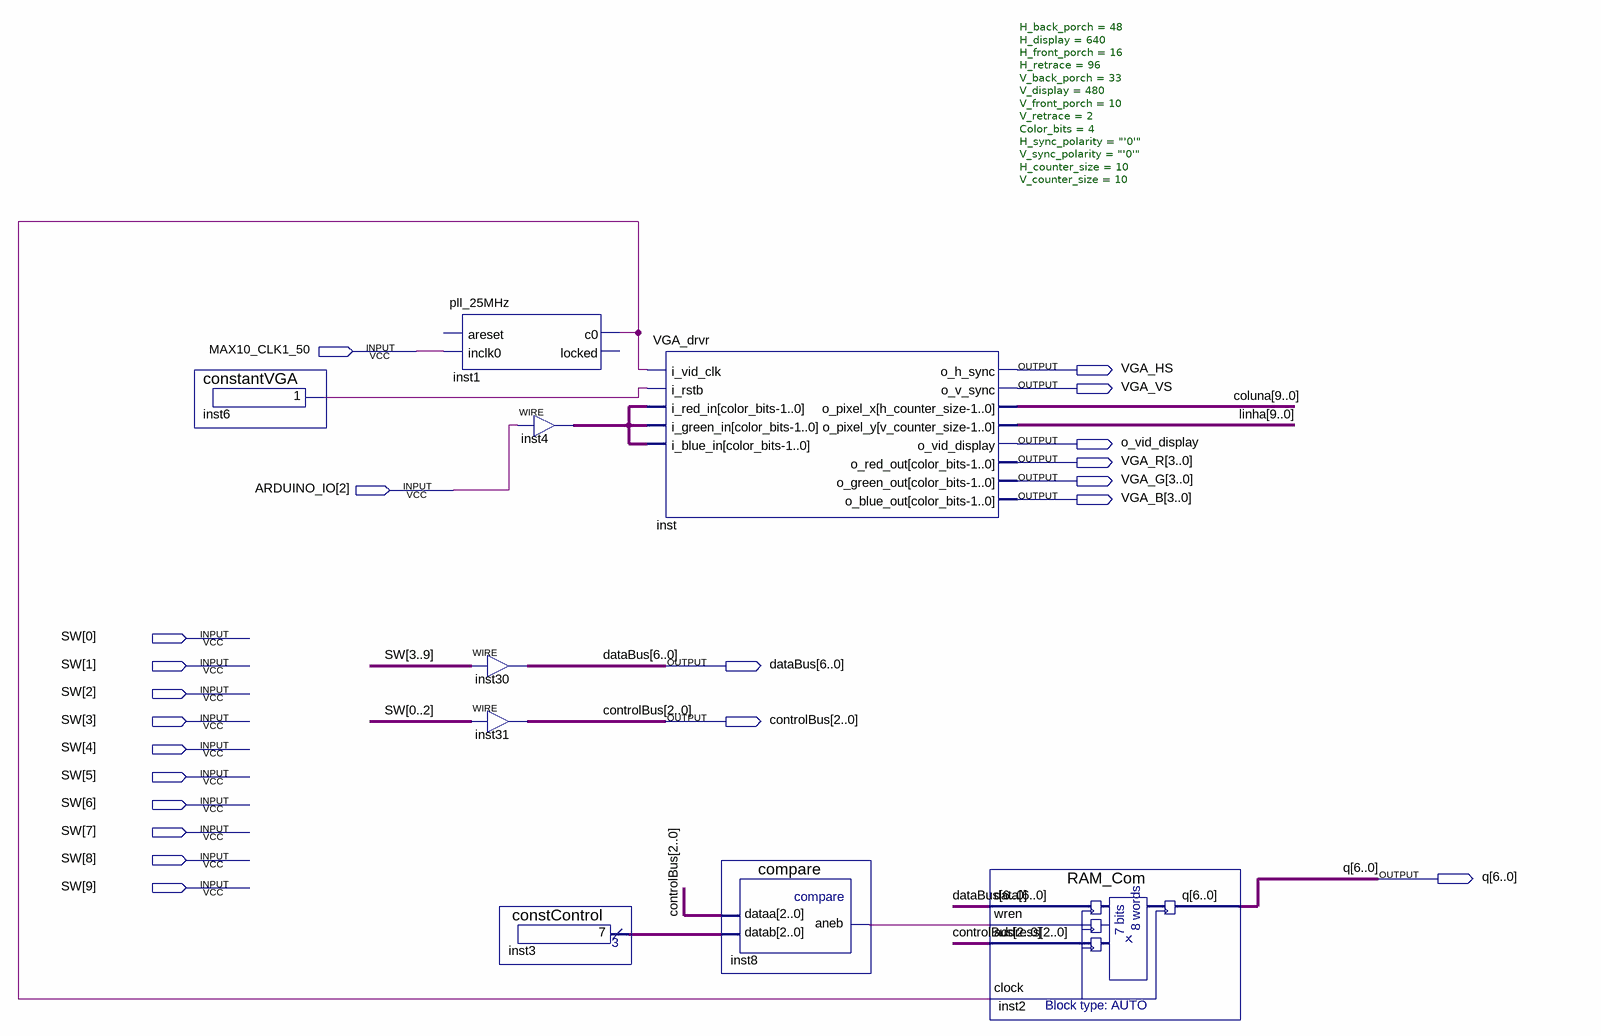
[diagram p0: schematic sheet]
// Quartus schematic vga1.bdf as structural Verilog: 9 symbols, 21 pins
module vga1 (
  input  MAX10_CLK1_50,
  input  [2:2] ARDUINO_IO,
  input  [9:0] SW,
  output VGA_HS,
  output VGA_VS,
  output o_vid_display,
  output [3:0] VGA_R,
  output [3:0] VGA_G,
  output [3:0] VGA_B,
  output [6:0] dataBus,
  output [2:0] controlBus,
  output [6:0] q
);

  wire inst1_c0, inst6_result, inst8_aneb;
  wire [2:0] inst3_result;
  wire [3:0] inst4_out;
  wire [9:0] coluna, linha;

  constantVGA inst6 (.result(inst6_result));
  pll_25MHz inst1 (.inclk0(MAX10_CLK1_50), .c0(inst1_c0));  // open: areset, locked
  assign dataBus = {SW[3], SW[4], SW[5], SW[6], SW[7], SW[8], SW[9]};  // WIRE inst30
  assign controlBus = {SW[0], SW[1], SW[2]};  // WIRE inst31
  constControl inst3 (.result(inst3_result));
  assign inst4_out = {4{ARDUINO_IO[2]}};  // WIRE inst4
  VGA_drvr #(.H_back_porch(48), .H_display(640), .H_front_porch(16), .H_retrace(96), .V_back_porch(33), .V_display(480), .V_front_porch(10), .V_retrace(2), .Color_bits(4), .H_sync_polarity("'0'"), .V_sync_polarity("'0'"), .H_counter_size(10), .V_counter_size(10)) inst (
    .i_vid_clk(inst1_c0), .i_rstb(inst6_result), .i_red_in(inst4_out), .i_green_in(inst4_out),
    .i_blue_in(inst4_out), .o_h_sync(VGA_HS), .o_v_sync(VGA_VS), .o_pixel_x(coluna), .o_pixel_y(linha),
    .o_vid_display(o_vid_display), .o_red_out(VGA_R), .o_green_out(VGA_G), .o_blue_out(VGA_B));
  compare inst8 (.dataa(controlBus), .datab(inst3_result), .aneb(inst8_aneb));
  RAM_Com inst2 (.data(dataBus), .wren(inst8_aneb), .address(controlBus), .clock(inst1_c0), .q(q));
endmodule
